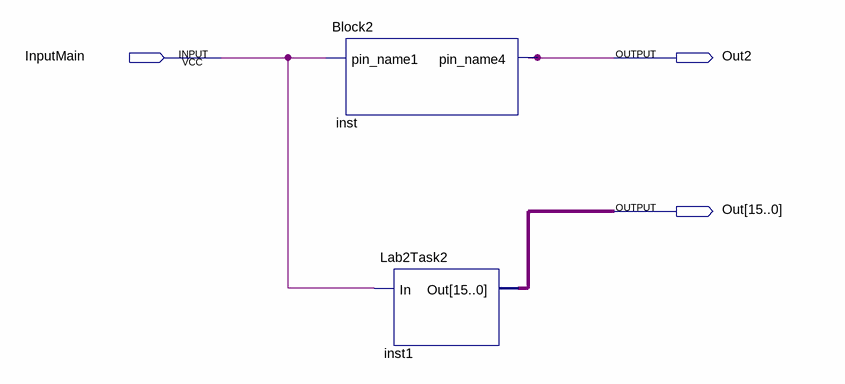
[diagram p0: schematic sheet]
// Quartus schematic top.bdf as structural Verilog: 2 symbols, 3 pins
module top (
  input  InputMain,
  output Out2,
  output [15:0] Out
);

  Block2 inst (.pin_name1(InputMain), .pin_name4(Out[2]));
  Lab2Task2 inst1 (.In(InputMain), .Out(Out));

  assign Out2 = Out[2];
endmodule
